# Altium schematic sheet top.SchDoc: Top
size A3; DrawnBy: Stefan Lippuner; Organization: TIK; DocumentNumber: 1; Revision: 2; SheetNumber: 1; SheetTotal: 8; ProjectName: RocketLogger
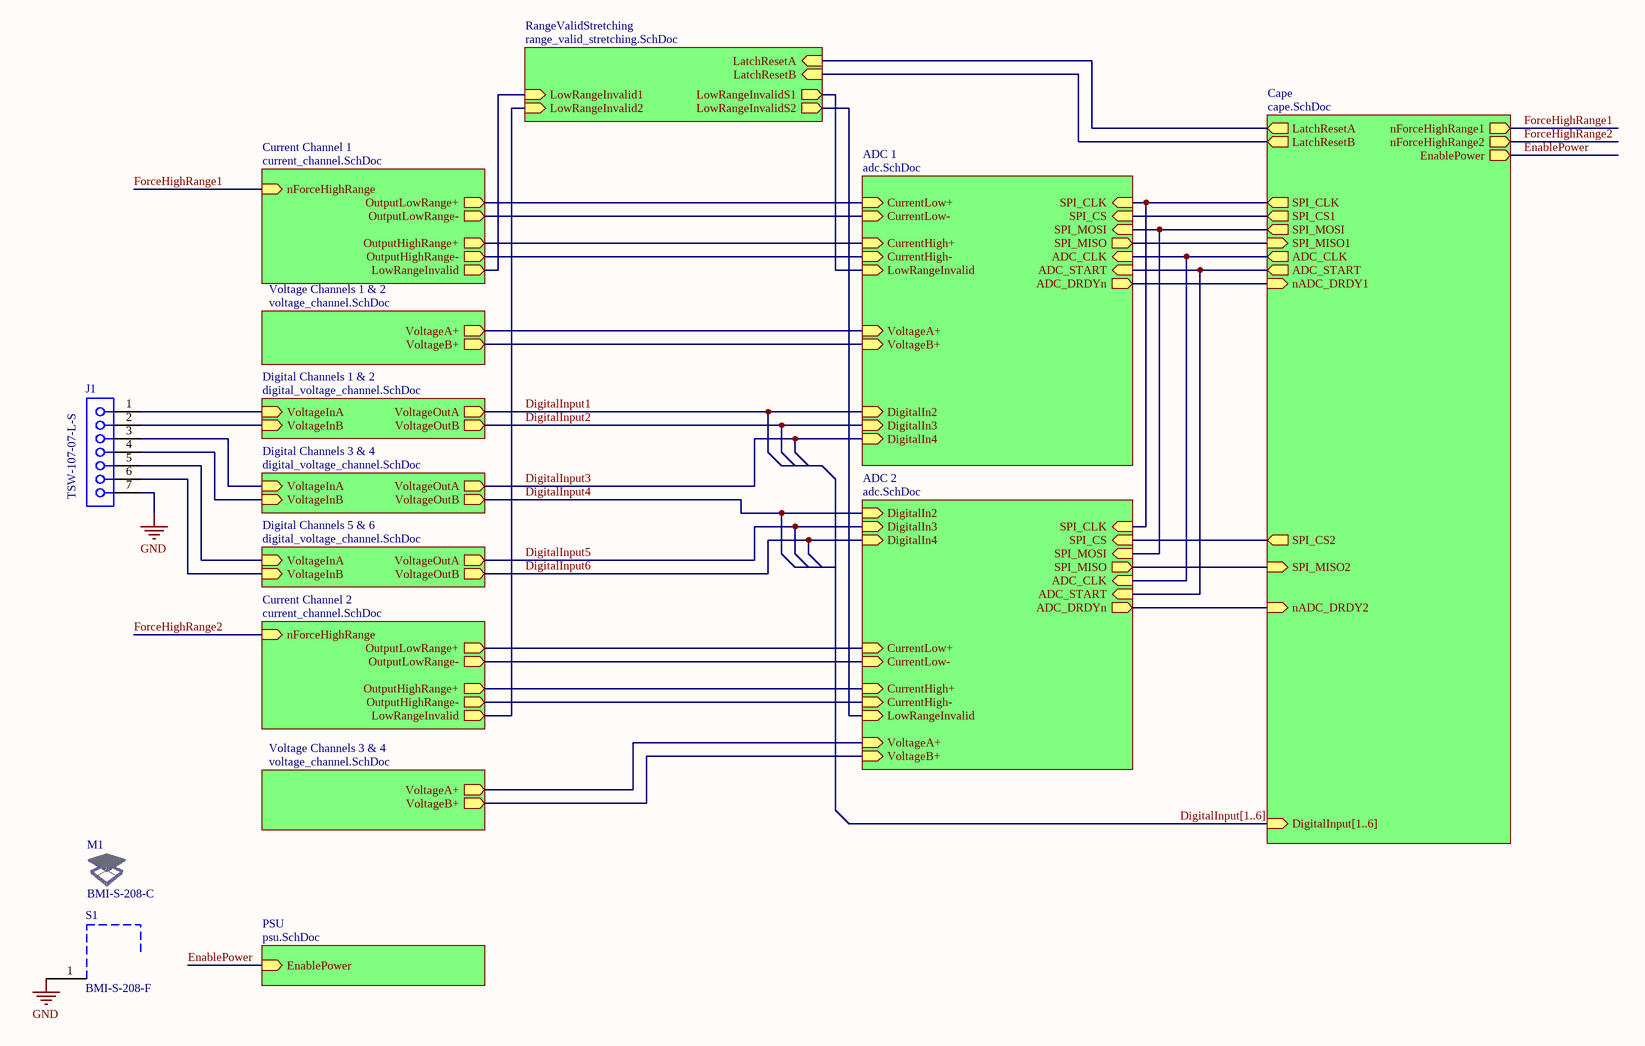
[diagram p0: top.SchDoc]

## Parts
J1  TSW-107-07-L-S  [TSW-107-07-L-S]
M1  BMI-S-208-C  (mechanical)
S1  BMI-S-208-F  [BMI-S-208-F]

## Sub-sheets
ADC 1 = adc.SchDoc: CurrentHigh+ (in), CurrentHigh- (in), CurrentLow+ (in), SPI_CS (in), ADC_DRDYn (out), SPI_MOSI (in), ADC_CLK (in), ADC_START (in), SPI_CLK (in), SPI_MISO (out), LowRangeInvalid (in), DigitalIn3 (in), DigitalIn4 (in), DigitalIn2 (in), CurrentLow- (in), VoltageA+ (in), VoltageB+ (in)
ADC 2 = adc.SchDoc: CurrentHigh+ (in), CurrentHigh- (in), CurrentLow+ (in), SPI_CS (in), ADC_DRDYn (out), SPI_MOSI (in), ADC_CLK (in), ADC_START (in), SPI_CLK (in), SPI_MISO (out), LowRangeInvalid (in), DigitalIn3 (in), DigitalIn4 (in), DigitalIn2 (in), CurrentLow- (in), VoltageA+ (in), VoltageB+ (in)
Cape = cape.SchDoc: nADC_DRDY2 (in), SPI_CS1 (out), ADC_CLK (out), SPI_CS2 (out), ADC_START (out), nForceHighRange1 (out), nForceHighRange2 (out), SPI_CLK (out), SPI_MOSI (out), nADC_DRDY1 (in), SPI_MISO1 (in), SPI_MISO2 (in), LatchResetA (out), LatchResetB (out), DigitalInput[1..6] (in), EnablePower (out)
Current Channel 1 = current_channel.SchDoc: nForceHighRange (in), LowRangeInvalid (out), OutputHighRange+ (out), OutputLowRange+ (out), OutputHighRange- (out), OutputLowRange- (out)
Current Channel 2 = current_channel.SchDoc: nForceHighRange (in), LowRangeInvalid (out), OutputLowRange+ (out), OutputHighRange+ (out), OutputHighRange- (out), OutputLowRange- (out)
Digital Channels 1 & 2 = digital_voltage_channel.SchDoc: VoltageOutA (out), VoltageInB (in), VoltageInA (in), VoltageOutB (out)
Digital Channels 3 & 4 = digital_voltage_channel.SchDoc: VoltageOutA (out), VoltageInB (in), VoltageInA (in), VoltageOutB (out)
Digital Channels 5 & 6 = digital_voltage_channel.SchDoc: VoltageOutA (out), VoltageInB (in), VoltageInA (in), VoltageOutB (out)
PSU = psu.SchDoc: EnablePower (in)
RangeValidStretching = range_valid_stretching.SchDoc: LowRangeInvalid1 (in), LowRangeInvalidS2 (out), LatchResetB (in), LowRangeInvalid2 (in), LatchResetA (in), LowRangeInvalidS1 (out)
Voltage Channels 1 & 2 = voltage_channel.SchDoc: VoltageB+ (out), VoltageA+ (out)
Voltage Channels 3 & 4 = voltage_channel.SchDoc: VoltageB+ (out), VoltageA+ (out)

## Nets
GND: J1.7 S1.1
DigitalInput1: sheet ADC 1/DigitalIn2, sheet Digital Channels 1 & 2/VoltageOutA
DigitalInput2: sheet ADC 1/DigitalIn3, sheet Digital Channels 1 & 2/VoltageOutB
DigitalInput3: sheet ADC 1/DigitalIn4, sheet Digital Channels 3 & 4/VoltageOutA
DigitalInput4: sheet ADC 2/DigitalIn2, sheet Digital Channels 3 & 4/VoltageOutB
DigitalInput5: sheet ADC 2/DigitalIn3, sheet Digital Channels 5 & 6/VoltageOutA
DigitalInput6: sheet ADC 2/DigitalIn4, sheet Digital Channels 5 & 6/VoltageOutB
EnablePower: sheet PSU/EnablePower, sheet Cape/EnablePower
ForceHighRange1: sheet Current Channel 1/nForceHighRange, sheet Cape/nForceHighRange1
ForceHighRange2: sheet Cape/nForceHighRange2, sheet Current Channel 2/nForceHighRange
NetJ1_1: J1.1 ; sheet Digital Channels 1 & 2/VoltageInA
NetJ1_2: J1.2 ; sheet Digital Channels 1 & 2/VoltageInB
NetJ1_3: J1.3 ; sheet Digital Channels 3 & 4/VoltageInA
NetJ1_4: J1.4 ; sheet Digital Channels 3 & 4/VoltageInB
NetJ1_5: J1.5 ; sheet Digital Channels 5 & 6/VoltageInA
NetJ1_6: J1.6 ; sheet Digital Channels 5 & 6/VoltageInB
(unnamed): sheet Current Channel 1/LowRangeInvalid, sheet RangeValidStretching/LowRangeInvalid1
(unnamed): sheet Current Channel 1/OutputHighRange+, sheet ADC 1/CurrentHigh+
(unnamed): sheet Current Channel 1/OutputLowRange+, sheet ADC 1/CurrentLow+
(unnamed): sheet Current Channel 1/OutputHighRange-, sheet ADC 1/CurrentHigh-
(unnamed): sheet Current Channel 1/OutputLowRange-, sheet ADC 1/CurrentLow-
(unnamed): sheet ADC 1/SPI_CS, sheet Cape/SPI_CS1
(unnamed): sheet ADC 1/ADC_DRDYn, sheet Cape/nADC_DRDY1
(unnamed): sheet ADC 1/SPI_MOSI, sheet Cape/SPI_MOSI, sheet ADC 2/SPI_MOSI
(unnamed): sheet ADC 1/ADC_CLK, sheet Cape/ADC_CLK, sheet ADC 2/ADC_CLK
(unnamed): sheet ADC 1/ADC_START, sheet Cape/ADC_START, sheet ADC 2/ADC_START
(unnamed): sheet ADC 1/SPI_CLK, sheet Cape/SPI_CLK, sheet ADC 2/SPI_CLK
(unnamed): sheet ADC 1/SPI_MISO, sheet Cape/SPI_MISO1
(unnamed): sheet ADC 1/LowRangeInvalid, sheet RangeValidStretching/LowRangeInvalidS1
(unnamed): sheet ADC 1/VoltageA+, sheet Voltage Channels 1 & 2/VoltageA+
(unnamed): sheet ADC 1/VoltageB+, sheet Voltage Channels 1 & 2/VoltageB+
(unnamed): sheet Cape/nADC_DRDY2, sheet ADC 2/ADC_DRDYn
(unnamed): sheet Cape/SPI_CS2, sheet ADC 2/SPI_CS
(unnamed): sheet Cape/SPI_MISO2, sheet ADC 2/SPI_MISO
(unnamed): sheet Cape/LatchResetA, sheet RangeValidStretching/LatchResetA
(unnamed): sheet Cape/LatchResetB, sheet RangeValidStretching/LatchResetB
(unnamed): sheet Voltage Channels 3 & 4/VoltageB+, sheet ADC 2/VoltageB+
(unnamed): sheet Voltage Channels 3 & 4/VoltageA+, sheet ADC 2/VoltageA+
(unnamed): sheet Current Channel 2/LowRangeInvalid, sheet RangeValidStretching/LowRangeInvalid2
(unnamed): sheet Current Channel 2/OutputLowRange+, sheet ADC 2/CurrentLow+
(unnamed): sheet Current Channel 2/OutputHighRange+, sheet ADC 2/CurrentHigh+
(unnamed): sheet Current Channel 2/OutputHighRange-, sheet ADC 2/CurrentHigh-
(unnamed): sheet Current Channel 2/OutputLowRange-, sheet ADC 2/CurrentLow-
(unnamed): sheet ADC 2/LowRangeInvalid, sheet RangeValidStretching/LowRangeInvalidS2

## Buses and harness runs
bus DigitalInput[1..6] = sheet Cape/DigitalInput[1..6]

## Notes on the sheet
- 1
- 2
- 3
- 4
- 5
- 6
- 7
- 8
- A
- B
- C
- D
- Project:
- Date:
- Drawing number:
- Rev:
- Format:
- A3
- Drawn by:
- Laboratory:
- Page
- Sheet:
- of
- File:

## Library data of the parts
J1 = TSW-107-07-L-S: Conn Unshrouded Header HDR 7 POS 2.54mm Solder ST Thru-Hole; Supplier 1: Digi-Key; Supplier Part Number 1: SAM1031-07-ND
M1 = CMP-00232-1: Board Mount EMI Enclosures RF Absorber CRS Tin SMD; Manufacturer: Laird; rohs_status: Compliant; Octopart Url: http://octopart.com/bmi-s-208-c-laird-25737658; Seller Landing  Url: https://octopart-clicks.com/click/track?country=CH&ak=8157f166&sig=01c10b9&sid=2401&ppid=25737658&vpid=232400018&ct=offers; OctopartID: da4312c1469f0584; Supplier: Mouser; Supplier Part Number: Mouser - 739-BMI-S-208-C
S1 = CMP-00123-4: EMI Connector Gaskets & Grounding Pads BLS,2PSH,FRM,SnSat .276x1.559x1.559in; Manufacturer: Laird Technologies EMI; Packaging: Tape & Reel (TR); Type: Frame; Height - Overall: 0.276" (7.00mm); Length - Overall: 1.559" (39.60mm); Width - Overall: 1.559" (39.60mm); Ventilation: -; Mounting Type: Solder; Manufacturer Part Number: BMI-S-208-F; Supplier: Digi-Key; Supplier Part Number: BMI-S-208-F-ND; ComponentLink1Description: EMI-CAT-Essentials%201213.pdf; ComponentLink1URL: http://www.lairdtech.com/brandworld/library/EMI-CAT-Essentials%201213.pdf